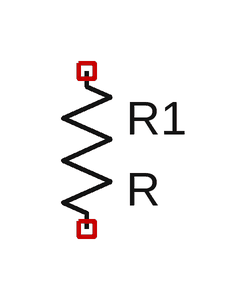
[diagram p0: schematic Battery_model.asc]
Battery_model.asc, the LTspice schematic file:
Version 4
SHEET 1 880 680
SYMBOL res 112 96 R0
SYMATTR InstName R1

The netlist it stands for:
* Battery_model.asc
R1 NC_01 NC_02 R
.backanno
.end